# EAGLE design hub-proto02 (EAGLE 7.3.0)
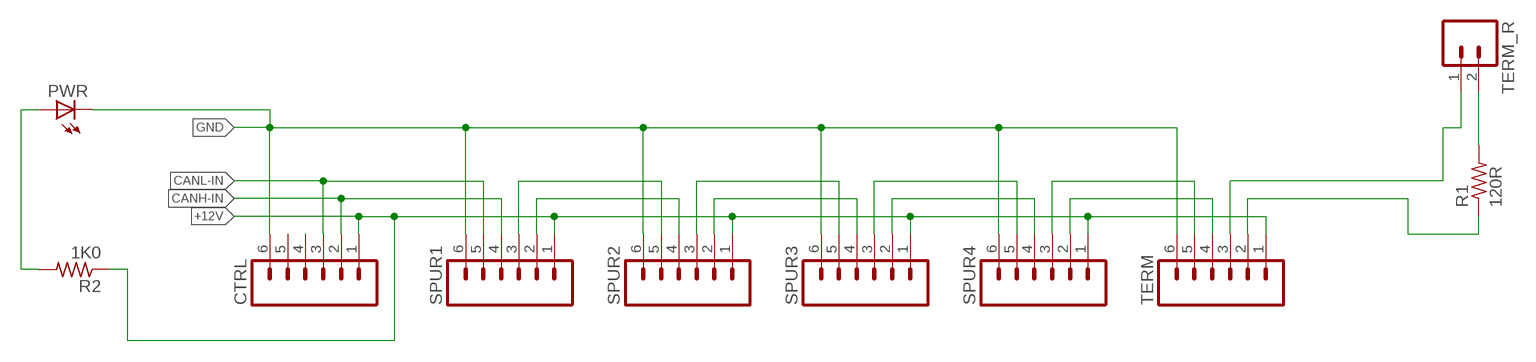
[diagram p0: schematic, sheet 1]

## Parts
CTRL  M06  [06P]
PWR  LED3MM  [LED3MM]
R1  120R  R-US_0309/12  [0309/12]
R2  1K0  R-US_0309/12  [0309/12]
SPUR1  M06  [06P]
SPUR2  M06  [06P]
SPUR3  M06  [06P]
SPUR4  M06  [06P]
TERM  M06  [06P]
TERM_R  M02  [02P]

## Nets
+12V: CTRL.1 R2.1 SPUR1.1 SPUR2.1 SPUR3.1 SPUR4.1 TERM.1
CANH-IN: CTRL.2 SPUR1.4
CANH-OUT: R1.1 TERM.2
CANL-IN: CTRL.3 SPUR1.5
CANL-OUT: TERM.3 TERM_R.1
GND: CTRL.6 PWR.K(C) SPUR1.6 SPUR2.6 SPUR3.6 SPUR4.6 TERM.6
N$1: R1.2 TERM_R.2
N$5: SPUR1.2 SPUR2.4
N$6: SPUR1.3 SPUR2.5
N$7: SPUR4.2 TERM.4
N$8: SPUR4.3 TERM.5
N$9: SPUR2.3 SPUR3.5
N$10: SPUR2.2 SPUR3.4
N$11: SPUR3.3 SPUR4.5
N$12: SPUR3.2 SPUR4.4
N$15: PWR.A R2.2
Unconnected: CTRL.4 CTRL.5

## Library data of the parts
CTRL SPUR1-SPUR4 TERM = con-amp-quick:M06: AMP QUICK CONNECTOR; OC_FARNELL: unknown; OC_NEWARK: unknown
PWR = led:LED: LED OSRAM: - CHIPLED LG R971, LG N971, LY N971, LG Q971, LY Q971, LO R971, LY R971 LH N974, LH R974 LS Q976, LO Q976, LY Q976 LO Q996 - Hyper CHIPLED LW Q18S LB Q993, LB Q99A, LB R99A - SideLED LS A670, LO A670, LY A670, LG A670, LP A670 LB A673, LV A673, LT A673, LW A673 LH A674 LY A675 LS A676, LA A676, LO A676, LY A676, LW A676 LS A679, LY A679, LG A679 - Hyper Micro SIDELED® LS Y876, LA Y876, LO Y876, LY Y876 LT Y87S - SmartLED LW L88C, LW L88S LB L89C, LB L89S, LG L890 LS L89K, LO L89K, LY L89K LS L896, LA L896, LO L896, LY L896 - TOPLED LS T670, LO T670, LY T670, LG T670, LP T670 LSG T670, LSP T670, LSY T670, LOP T670, LYG T670 LG T671, LOG T671, LSG T671 LB T673, LV T673, LT T673, LW T673 LH T674 LS T676, LA T676, LO T676, LY T676, LB T676, LH T676, LSB T676, LW T676 LB T67C, LV T67C, LT T67C, LS T67K, LO T67K, LY T67K, LW E67C LS E67B, LA E67B, LO E67B, LY E67B, LB E67C, LV E67C, LT E67C LW T67C LS T679, LY T679, LG T679 LS T770, LO T770, LY T770, LG T770, LP T770 LB T773, LV T773, LT T773, LW T773 LH T774 LS E675, LA E675, LY E675, LS T675 LS T776, LA T776, LO T776, LY T776, LB T776 LHGB T686 LT T68C, LB T68C - Hyper Mini TOPLED® LB M676 - Mini TOPLED Santana® LG M470 LS M47K, LO M47K, LY M47K Source: http://www.osram.convergy.de LUXEON: - LUMILED® LXK2-PW12-R00, LXK2-PW12-S00, LXK2-PW14-U00, LXK2-PW14-V00 LXK2-PM12-R00, LXK2-PM12-S00, LXK2-PM14-U00 LXK2-PE12-Q00, LXK2-PE12-R00, LXK2-PE12-S00, LXK2-PE14-T00, LXK2-PE14-U00 LXK2-PB12-K00, LXK2-PB12-L00, LXK2-PB12-M00, LXK2-PB14-N00, LXK2-PB14-P00, LXK2-PB14-Q00 LXK2-PR12-L00, LXK2-PR12-M00, LXK2-PR14-Q00, LXK2-PR14-R00 LXK2-PD12-Q00, LXK2-PD12-R00, LXK2-PD12-S00 LXK2-PH12-R00, LXK2-PH12-S00 LXK2-PL12-P00, LXK2-PL12-Q00, LXK2-PL12-R00 Source: www.luxeon.com KINGBRIGHT: KA-3528ASYC Source: www.kingbright.com
R1 R2 = rcl:R-US_: RESISTOR, American symbol
TERM_R = con-amp-quick:M02: AMP QUICK CONNECTOR; OC_FARNELL: unknown; OC_NEWARK: unknown

## Board
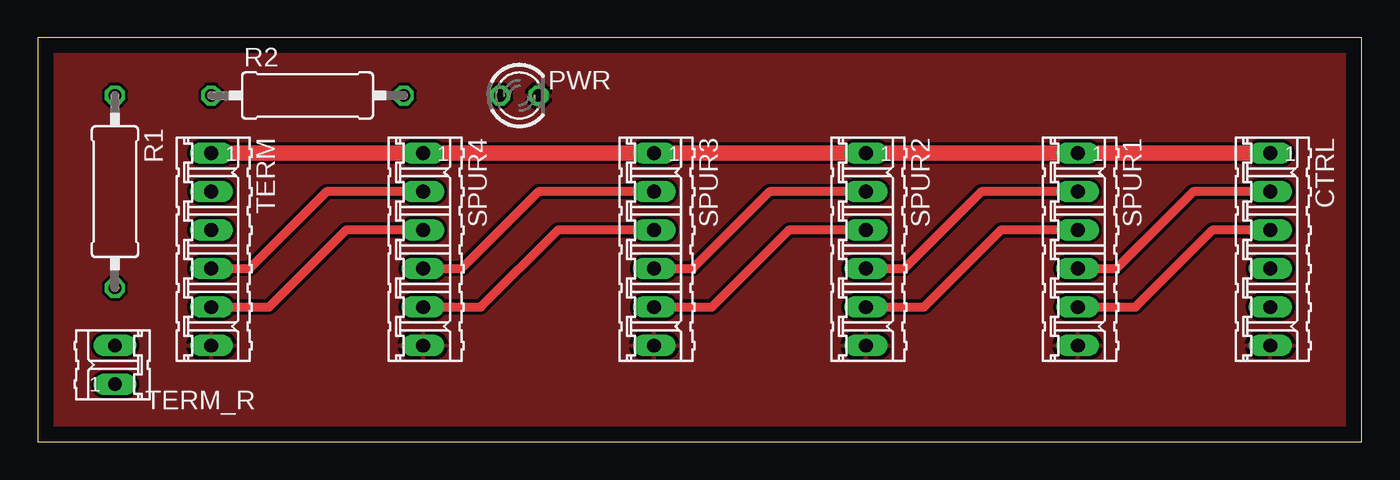
[diagram p1: board, top side]
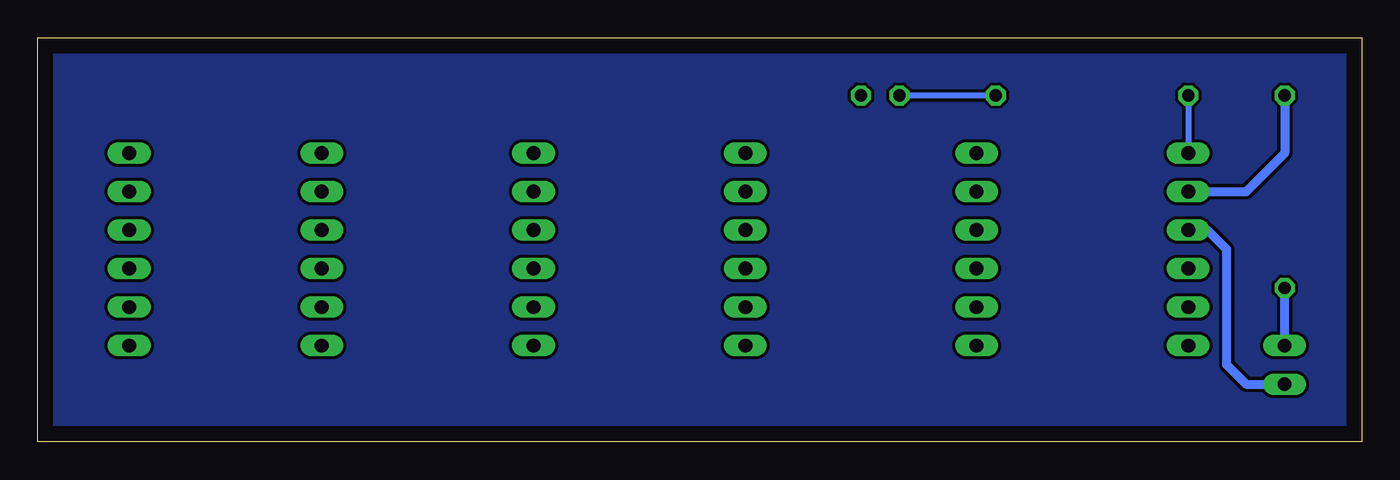
[diagram p2: board, bottom side, seen from below]

Size 87.3 x 26.66 mm. Coordinates in mm from the lower left corner, seen from the top.
Outline: 0,0 87.3,0 87.3,26.66 0,26.66 0,0
Copper layers (1*16): Top 0.035mm / dielectric 1.5mm / Bottom 0.035mm
Design rules "default": minimum track width 10mil, minimum drill 24mil, track to track 8mil, track to pad 8mil, pad to pad 8mil, via to via 8mil, smd to smd 8mil, copper to edge 40mil, drill to drill 8mil, minimum pad ring 10mil, minimum via ring 8mil, stop-mask expansion 4mil, vias tented up to drill 0mil, thermal gap 10mil

### Footprints (pad centres in the part's own frame; a part is rotated, then mirrored left to right if it is on the bottom)
06P = drill 0.914 long: 1 -6.35,0; 2 -3.81,0; 3 -1.27,0; 4 1.27,0; 5 3.81,0; 6 6.35,0
LED3MM = drill 0.813 octagon: A -1.27,0; K 1.27,0
0309/12 = drill 0.813 octagon: 1 -6.35,0; 2 6.35,0
02P = drill 0.914 long: 1 -1.27,0; 2 1.27,0

### Placement (x,y rotation side)
CTRL  81.28,12.7 270 top
PWR  31.75,22.86 0 top
R1  5.08,16.51 270 top
R2  17.78,22.86 0 top
SPUR1  68.58,12.7 270 top
SPUR2  54.61,12.7 270 top
SPUR3  40.64,12.7 270 top
SPUR4  25.4,12.7 270 top
TERM  11.43,12.7 270 top
TERM_R  5.08,5.08 90 top

### Tracks (layer width: path | path; a pad name or v marks a point on that pad's centre or on a via)
+12V
  Top 1.016: TERM.1 SPUR4.1 SPUR3.1 SPUR2.1 SPUR1.1 CTRL.1
  Bottom 0.406: R2.1 TERM.1
CANH-IN
  Top 0.61: SPUR1.4 71.12,11.43 76.2,16.51 CTRL.2
CANH-OUT
  Bottom 0.61: TERM.2 7.62,16.51 5.08,19.05 R1.1
CANL-IN
  Top 0.61: SPUR1.5 72.39,8.89 77.47,13.97 CTRL.3
CANL-OUT
  Bottom 0.61: TERM.3 10.16,13.97 8.89,12.7 8.89,5.08 7.62,3.81 TERM_R.1
GND
  pour Top: 0,26.67 87.63,26.67 87.63,0 0,0
N$1
  Bottom 0.61: TERM_R.2 R1.2
N$5
  Top 0.61: SPUR2.4 57.15,11.43 62.23,16.51 SPUR1.2
N$6
  Top 0.61: SPUR2.5 58.42,8.89 63.5,13.97 SPUR1.3
N$7
  Top 0.61: TERM.4 13.97,11.43 19.05,16.51 SPUR4.2
N$8
  Top 0.61: TERM.5 15.24,8.89 20.32,13.97 SPUR4.3
N$9
  Top 0.61: SPUR3.5 44.45,8.89 49.53,13.97 SPUR2.3
N$10
  Top 0.61: SPUR3.4 43.18,11.43 48.26,16.51 SPUR2.2
N$11
  Top 0.61: SPUR4.5 29.21,8.89 34.29,13.97 SPUR3.3
N$12
  Top 0.61: SPUR4.4 27.94,11.43 33.02,16.51 SPUR3.2
N$14
  pour Bottom: 0,26.67 87.63,26.67 87.63,0 0,0
N$15
  Bottom 0.406: R2.2 PWR.A